# EasyEDA Pro project uven2-mk3-cc-driver-single.eprj, board uven2-mk3-cc-driver
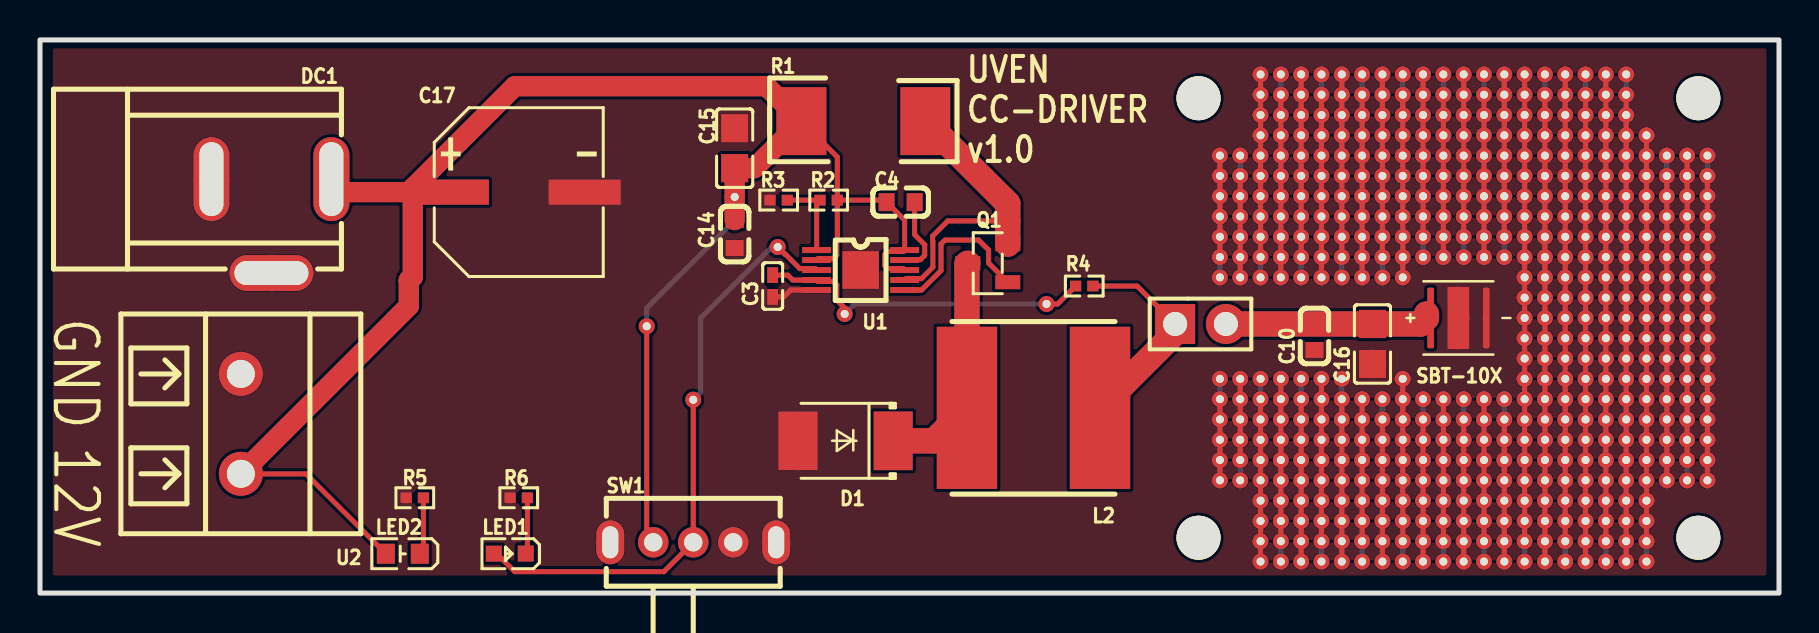
[diagram p1: board, top side]
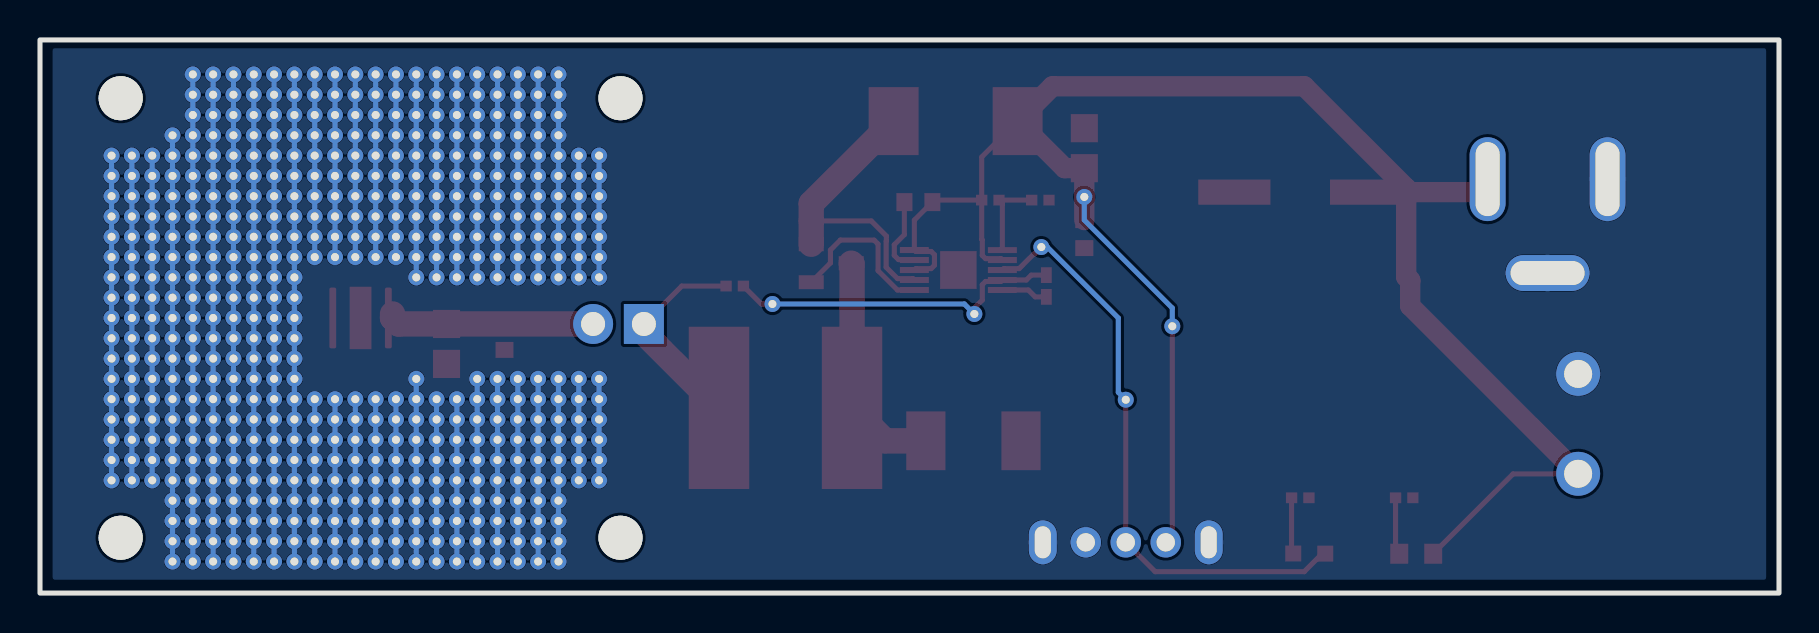
[diagram p2: board, bottom side, seen from below]

Outline 86.98 x 27.69 mm; copper layers: Top Layer, Bottom Layer. Coordinates in mm from the lower left corner of the outline.
Outline path: rectangle 0,27.69 86.98,0
Stack: Top Layer 0.035mm / Dielectric1 1.51mm FR4 er 4.5 / Bottom Layer 0.035mm

## Design rules (mm)
template: User Custom Config
spacing safeClearance (default): track to track 0.152, other pairs 0.152 to 0.3
track width trackWidth (default): min 0.127, default 0.254, max 2.54
differential pair differentialPair (default): width min 0.127, default 0.254, max 2.54; gap min 0.152, default 0.152
via viaSize (default): diameter min 0.5, default 0.61, max 10; hole min 0.3, default 0.305, max 5.999
net Net-(J3-Pin_1) uses CopperRegion3

## Placement (name value [footprint] x y rotation side)
C3  1nF  [C0402]  36.65 15.37 90 top
C4  1uF  [C0603]  43.05 19.57 180 top
C10  470nF  [C0603]  63.75 12.87 90 top
C14  1uF  [C0603]  34.75 17.97 90 top
C15  10uF  [C0805]  34.75 22.27 270 top
C16  47uF  [C0805]  66.65 12.47 90 top
C17  470uF  [CAP-SMD_BD8.0-L8.3-W8.3-LS9.1-FD]  23.95 20.07 0 top
D1  SR34_R2_00001  [SMB_L4.3-W3.6-LS5.4-R-RD]  40.29 7.62 180 top
DC1  DC-005-2.5A-2.0  [CONN-TH_DC-005-2.5A-2.0]  11.58 18.37 0 top
H1  MountingHole  [MountingHole:MountingHole_2.2mm_M2]  57.95 24.77 0 top
H2  MountingHole  [MountingHole:MountingHole_2.2mm_M2]  82.95 24.77 0 top
H3  MountingHole  [MountingHole:MountingHole_2.2mm_M2]  57.95 2.77 0 top
H4  MountingHole  [MountingHole:MountingHole_2.2mm_M2]  82.95 2.77 0 top
H5  PZ254V-11-02P  [HDR-TH_2P-P2.54-V-M]  58.05 13.47 0 top
L2  15uH  [IND-SMD_L8.0-W8.0-HPC8040NF-150M]  49.69 9.27 180 top
LED1  CSL0901BT1C  [LED0603-RD_BLUE]  23.5 1.97 180 top
LED2  XL-1608SURC-06FJ  [LED0603-FD]  18.15 1.97 0 top
NOREF  -  [Pad_e312]  40.25 13.97 0 top
NOREF#2  -  [Pad_e6127]  82.39 13.77 0 top
NOREF#3  -  [Pad_e6410]  65.11 1.58 0 top
NOREF#4  -  [Pad_e6005]  60.03 17.83 0 top
NOREF#5  -  [Pad_e6386]  66.13 2.59 0 top
NOREF#6  -  [Pad_e5849]  79.34 24.95 0 top
NOREF#7  -  [Pad_e6412]  67.15 1.58 0 top
NOREF#8  -  [Pad_e5978]  83.4 19.87 0 top
NOREF#9  -  [Pad_e5932]  62.07 20.88 0 top
NOREF#10  -  [Pad_e5981]  61.05 18.85 0 top
NOREF#11  -  [Pad_e6097]  77.31 14.79 0 top
NOREF#12  -  [Pad_e5859]  64.1 23.93 0 top
NOREF#13  -  [Pad_e6241]  71.21 8.69 0 top
NOREF#14  -  [Pad_e6009]  64.1 17.83 0 top
NOREF#15  -  [Pad_e6408]  63.08 1.58 0 top
NOREF#16  -  [Pad_e6313]  68.16 5.64 0 top
NOREF#17  -  [Pad_e6363]  68.16 3.61 0 top
NOREF#18  -  [Pad_e6201]  81.37 10.72 0 top
NOREF#19  -  [Pad_e5965]  70.19 19.87 0 top
NOREF#20  -  [Pad_e6037]  67.15 16.82 0 top
NOREF#21  -  [Pad_e6175]  80.35 11.74 0 top
NOREF#22  -  [Pad_e6148]  78.32 12.75 0 top
NOREF#23  -  [Pad_e5865]  70.19 23.93 0 top
NOREF#24  -  [Pad_e5918]  73.24 21.9 0 top
NOREF#25  -  [Pad_e5821]  76.29 25.96 0 top
NOREF#26  -  [Pad_e6123]  78.32 13.77 0 top
NOREF#27  -  [Pad_e6125]  80.35 13.77 0 top
NOREF#28  -  [Pad_e6388]  68.16 2.59 0 top
NOREF#29  -  [Pad_e5962]  67.15 19.87 0 top
NOREF#30  -  [Pad_e6212]  67.15 9.71 0 top
NOREF#31  -  [Pad_e6242]  72.23 8.69 0 top
NOREF#32  -  [Pad_e6058]  63.08 15.8 0 top
NOREF#33  -  [Pad_e5974]  79.34 19.87 0 top
NOREF#34  -  [Pad_e6332]  62.07 4.62 0 top
NOREF#35  -  [Pad_e6044]  74.26 16.82 0 top
NOREF#36  -  [Pad_e5982]  62.07 18.85 0 top
NOREF#37  -  [Pad_e6411]  66.13 1.58 0 top
NOREF#38  -  [Pad_e6415]  70.19 1.58 0 top
NOREF#39  -  [Pad_e6124]  79.34 13.77 0 top
NOREF#40  -  [Pad_e6061]  66.13 15.8 0 top
NOREF#41  -  [Pad_e6371]  76.29 3.61 0 top
NOREF#42  -  [Pad_e6381]  61.05 2.59 0 top
NOREF#43  -  [Pad_e6001]  81.37 18.85 0 top
NOREF#44  -  [Pad_e5856]  61.05 23.93 0 top
NOREF#45  -  [Pad_e6390]  70.19 2.59 0 top
NOREF#46  -  [Pad_e6199]  79.34 10.72 0 top
NOREF#47  -  [Pad_e6039]  69.18 16.82 0 top
NOREF#48  -  [Pad_e6007]  62.07 17.83 0 top
NOREF#49  -  [Pad_e6180]  60.03 10.72 0 top
NOREF#50  -  [Pad_e5954]  59.02 19.87 0 top
NOREF#51  -  [Pad_e5931]  61.05 20.88 0 top
NOREF#52  -  [Pad_e6422]  77.31 1.58 0 top
NOREF#53  -  [Pad_e6295]  75.27 6.66 0 top
NOREF#54  -  [Pad_e6368]  73.24 3.61 0 top
NOREF#55  -  [Pad_e6220]  75.27 9.71 0 top
NOREF#56  -  [Pad_e5950]  80.35 20.88 0 top
NOREF#57  -  [Pad_e5967]  72.23 19.87 0 top
NOREF#58  -  [Pad_e6038]  68.16 16.82 0 top
NOREF#59  -  [Pad_e6262]  67.15 7.67 0 top
NOREF#60  -  [Pad_e6042]  72.23 16.82 0 top
NOREF#61  -  [Pad_e6268]  73.24 7.67 0 top
NOREF#62  -  [Pad_e5894]  74.26 22.91 0 top
NOREF#63  -  [Pad_e6026]  81.37 17.83 0 top
NOREF#64  -  [Pad_e6409]  64.1 1.58 0 top
NOREF#65  -  [Pad_e5921]  76.29 21.9 0 top
NOREF#66  -  [Pad_e5947]  77.31 20.88 0 top
NOREF#67  -  [Pad_e5988]  68.16 18.85 0 top
NOREF#68  -  [Pad_e6223]  78.32 9.71 0 top
NOREF#69  -  [Pad_e5966]  71.21 19.87 0 top
NOREF#70  -  [Pad_e6146]  76.29 12.75 0 top
NOREF#71  -  [Pad_e5871]  76.29 23.93 0 top
NOREF#72  -  [Pad_e5872]  77.31 23.93 0 top
NOREF#73  -  [Pad_e6205]  60.03 9.71 0 top
NOREF#74  -  [Pad_e6216]  71.21 9.71 0 top
NOREF#75  -  [Pad_e6048]  78.32 16.82 0 top
NOREF#76  -  [Pad_e6179]  59.02 10.72 0 top
NOREF#77  -  [Pad_e6316]  71.21 5.64 0 top
NOREF#78  -  [Pad_e5984]  64.1 18.85 0 top
NOREF#79  -  [Pad_e6169]  74.26 11.74 0 top
NOREF#80  -  [Pad_e6292]  72.23 6.66 0 top
NOREF#81  -  [Pad_e5838]  68.16 24.95 0 top
NOREF#82  -  [Pad_e6305]  60.03 5.64 0 top
NOREF#83  -  [Pad_e5913]  68.16 21.9 0 top
NOREF#84  -  [Pad_e6279]  59.02 6.66 0 top
NOREF#85  -  [Pad_e5935]  65.11 20.88 0 top
NOREF#86  -  [Pad_e6230]  60.03 8.69 0 top
NOREF#87  -  [Pad_e5808]  63.08 25.96 0 top
NOREF#88  -  [Pad_e5883]  63.08 22.91 0 top
NOREF#89  -  [Pad_e6243]  73.24 8.69 0 top
NOREF#90  -  [Pad_e5897]  77.31 22.91 0 top
NOREF#91  -  [Pad_e6237]  67.15 8.69 0 top
NOREF#92  -  [Pad_e6012]  67.15 17.83 0 top
NOREF#93  -  [Pad_e5848]  78.32 24.95 0 top
NOREF#94  -  [Pad_e6000]  80.35 18.85 0 top
NOREF#95  -  [Pad_e5835]  65.11 24.95 0 top
NOREF#96  -  [Pad_e5995]  75.27 18.85 0 top
NOREF#97  -  [Pad_e6250]  80.35 8.69 0 top
NOREF#98  -  [Pad_e5937]  67.15 20.88 0 top
NOREF#99  -  [Pad_e6196]  76.29 10.72 0 top
NOREF#100  -  [Pad_e6041]  71.21 16.82 0 top
NOREF#101  -  [Pad_e5949]  79.34 20.88 0 top
NOREF#102  -  [Pad_e6393]  73.24 2.59 0 top
NOREF#103  -  [Pad_e6062]  67.15 15.8 0 top
NOREF#104  -  [Pad_e6370]  75.27 3.61 0 top
NOREF#105  -  [Pad_e5991]  71.21 18.85 0 top
NOREF#106  -  [Pad_e5815]  70.19 25.96 0 top
NOREF#107  -  [Pad_e5968]  73.24 19.87 0 top
NOREF#108  -  [Pad_e5864]  69.18 23.93 0 top
NOREF#109  -  [Pad_e6188]  68.16 10.72 0 top
NOREF#110  -  [Pad_e6280]  60.03 6.66 0 top
NOREF#111  -  [Pad_e6060]  65.11 15.8 0 top
NOREF#112  -  [Pad_e6302]  82.39 6.66 0 top
NOREF#113  -  [Pad_e5958]  63.08 19.87 0 top
NOREF#114  -  [Pad_e6306]  61.05 5.64 0 top
NOREF#115  -  [Pad_e6020]  75.27 17.83 0 top
NOREF#116  -  [Pad_e6259]  64.1 7.67 0 top
NOREF#117  -  [Pad_e327]  32.67 9.68 0 top
NOREF#118  -  [Pad_e5987]  67.15 18.85 0 top
NOREF#119  -  [Pad_e5889]  69.18 22.91 0 top
NOREF#120  -  [Pad_e5842]  72.23 24.95 0 top
NOREF#121  -  [Pad_e6049]  79.34 16.82 0 top
NOREF#122  -  [Pad_e6002]  82.39 18.85 0 top
NOREF#123  -  [Pad_e2139]  30.35 13.36 0 top
NOREF#124  -  [Pad_e6373]  78.32 3.61 0 top
NOREF#125  -  [Pad_e6277]  82.39 7.67 0 top
NOREF#126  -  [Pad_e6183]  63.08 10.72 0 top
NOREF#127  -  [Pad_e6152]  82.39 12.75 0 top
NOREF#128  -  [Pad_e5942]  72.23 20.88 0 top
NOREF#129  -  [Pad_e6263]  68.16 7.67 0 top
NOREF#130  -  [Pad_e5904]  59.02 21.9 0 top
NOREF#131  -  [Pad_e6004]  59.02 17.83 0 top
NOREF#132  -  [Pad_e5920]  75.27 21.9 0 top
NOREF#133  -  [Pad_e6194]  74.26 10.72 0 top
NOREF#134  -  [Pad_e5964]  69.18 19.87 0 top
NOREF#135  -  [Pad_e5837]  67.15 24.95 0 top
NOREF#136  -  [Pad_e6153]  83.4 12.75 0 top
NOREF#137  -  [Pad_e6320]  75.27 5.64 0 top
NOREF#138  -  [Pad_e6270]  75.27 7.67 0 top
NOREF#139  -  [Pad_e6276]  81.37 7.67 0 top
NOREF#140  -  [Pad_e5963]  68.16 19.87 0 top
NOREF#141  -  [Pad_e5934]  64.1 20.88 0 top
NOREF#142  -  [Pad_e5836]  66.13 24.95 0 top
NOREF#143  -  [Pad_e6298]  78.32 6.66 0 top
NOREF#144  -  [Pad_e6228]  83.4 9.71 0 top
NOREF#145  -  [Pad_e6238]  68.16 8.69 0 top
NOREF#146  -  [Pad_e5868]  73.24 23.93 0 top
NOREF#147  -  [Pad_e5975]  80.35 19.87 0 top
NOREF#148  -  [Pad_e6341]  71.21 4.62 0 top
NOREF#149  -  [Pad_e5977]  82.39 19.87 0 top
NOREF#150  -  [Pad_e6234]  64.1 8.69 0 top
NOREF#151  -  [Pad_e6059]  64.1 15.8 0 top
NOREF#152  -  [Pad_e6288]  68.16 6.66 0 top
NOREF#153  -  [Pad_e6389]  69.18 2.59 0 top
NOREF#154  -  [Pad_e5909]  64.1 21.9 0 top
NOREF#155  -  [Pad_e6151]  81.37 12.75 0 top
NOREF#156  -  [Pad_e6214]  69.18 9.71 0 top
NOREF#157  -  [Pad_e5960]  65.11 19.87 0 top
NOREF#158  -  [Pad_e6366]  71.21 3.61 0 top
NOREF#159  -  [Pad_e6103]  83.4 14.79 0 top
NOREF#160  -  [Pad_e6321]  76.29 5.64 0 top
NOREF#161  -  [Pad_e6076]  81.37 15.8 0 top
NOREF#162  -  [Pad_e6369]  74.26 3.61 0 top
NOREF#163  -  [Pad_e5927]  82.39 21.9 0 top
NOREF#164  -  [Pad_e6281]  61.05 6.66 0 top
NOREF#165  -  [Pad_e6232]  62.07 8.69 0 top
NOREF#166  -  [Pad_e6324]  79.34 5.64 0 top
NOREF#167  -  [Pad_e6239]  69.18 8.69 0 top
NOREF#168  -  [Pad_e6027]  82.39 17.83 0 top
NOREF#169  -  [Pad_e5970]  75.27 19.87 0 top
NOREF#170  -  [Pad_e6312]  67.15 5.64 0 top
NOREF#171  -  [Pad_e6182]  62.07 10.72 0 top
NOREF#172  -  [Pad_e6218]  73.24 9.71 0 top
NOREF#173  -  [Pad_e6395]  75.27 2.59 0 top
NOREF#174  -  [Pad_e5926]  81.37 21.9 0 top
NOREF#175  -  [Pad_e6361]  66.13 3.61 0 top
NOREF#176  -  [Pad_e6204]  59.02 9.71 0 top
NOREF#177  -  [Pad_e5884]  64.1 22.91 0 top
NOREF#178  -  [Pad_e5824]  79.34 25.96 0 top
NOREF#179  -  [Pad_e6231]  61.05 8.69 0 top
NOREF#180  -  [Pad_e5972]  77.31 19.87 0 top
NOREF#181  -  [Pad_e6206]  61.05 9.71 0 top
NOREF#182  -  [Pad_e5943]  73.24 20.88 0 top
NOREF#183  -  [Pad_e6174]  79.34 11.74 0 top
NOREF#184  -  [Pad_e6384]  64.1 2.59 0 top
NOREF#185  -  [Pad_e6095]  75.27 14.79 0 top
NOREF#186  -  [Pad_e5998]  78.32 18.85 0 top
NOREF#187  -  [Pad_e6300]  80.35 6.66 0 top
NOREF#188  -  [Pad_e6074]  79.34 15.8 0 top
NOREF#189  -  [Pad_e6229]  59.02 8.69 0 top
NOREF#190  -  [Pad_e6264]  69.18 7.67 0 top
NOREF#191  -  [Pad_e6285]  65.11 6.66 0 top
NOREF#192  -  [Pad_e6227]  82.39 9.71 0 top
NOREF#193  -  [Pad_e5980]  60.03 18.85 0 top
NOREF#194  -  [Pad_e6207]  62.07 9.71 0 top
NOREF#195  -  [Pad_e5938]  68.16 20.88 0 top
NOREF#196  -  [Pad_e6177]  82.39 11.74 0 top
NOREF#197  -  [Pad_e6016]  71.21 17.83 0 top
NOREF#198  -  [Pad_e5948]  78.32 20.88 0 top
NOREF#199  -  [Pad_e5847]  77.31 24.95 0 top
NOREF#200  -  [Pad_e6176]  81.37 11.74 0 top
NOREF#201  -  [Pad_e6198]  78.32 10.72 0 top
NOREF#202  -  [Pad_e6011]  66.13 17.83 0 top
NOREF#203  -  [Pad_e6414]  69.18 1.58 0 top
NOREF#204  -  [Pad_e6297]  77.31 6.66 0 top
NOREF#205  -  [Pad_e6398]  78.32 2.59 0 top
NOREF#206  -  [Pad_e6278]  83.4 7.67 0 top
NOREF#207  -  [Pad_e5996]  76.29 18.85 0 top
NOREF#208  -  [Pad_e6071]  76.29 15.8 0 top
NOREF#209  -  [Pad_e5862]  67.15 23.93 0 top
NOREF#210  -  [Pad_e6063]  68.16 15.8 0 top
NOREF#211  -  [Pad_e6240]  70.19 8.69 0 top
NOREF#212  -  [Pad_e6236]  66.13 8.69 0 top
NOREF#213  -  [Pad_e6215]  70.19 9.71 0 top
NOREF#214  -  [Pad_e5810]  65.11 25.96 0 top
NOREF#215  -  [Pad_e5955]  60.03 19.87 0 top
NOREF#216  -  [Pad_e6256]  61.05 7.67 0 top
NOREF#217  -  [Pad_e6195]  75.27 10.72 0 top
NOREF#218  -  [Pad_e6416]  71.21 1.58 0 top
NOREF#219  -  [Pad_e6003]  83.4 18.85 0 top
NOREF#220  -  [Pad_e5990]  70.19 18.85 0 top
NOREF#221  -  [Pad_e6319]  74.26 5.64 0 top
NOREF#222  -  [Pad_e5994]  74.26 18.85 0 top
NOREF#223  -  [Pad_e5952]  82.39 20.88 0 top
NOREF#224  -  [Pad_e5923]  78.32 21.9 0 top
NOREF#225  -  [Pad_e6128]  83.4 13.77 0 top
NOREF#226  -  [Pad_e6392]  72.23 2.59 0 top
NOREF#227  -  [Pad_e5887]  67.15 22.91 0 top
NOREF#228  -  [Pad_e5806]  61.05 25.96 0 top
NOREF#229  -  [Pad_e6261]  66.13 7.67 0 top
NOREF#230  -  [Pad_e5929]  59.02 20.88 0 top
NOREF#231  -  [Pad_e5976]  81.37 19.87 0 top
NOREF#232  -  [Pad_e6178]  83.4 11.74 0 top
NOREF#233  -  [Pad_e5840]  70.19 24.95 0 top
NOREF#234  -  [Pad_e6336]  66.13 4.62 0 top
NOREF#235  -  [Pad_e6400]  80.35 2.59 0 top
NOREF#236  -  [Pad_e5993]  73.24 18.85 0 top
NOREF#237  -  [Pad_e6308]  63.08 5.64 0 top
NOREF#238  -  [Pad_e5941]  71.21 20.88 0 top
NOREF#239  -  [Pad_e5906]  61.05 21.9 0 top
NOREF#240  -  [Pad_e5989]  69.18 18.85 0 top
NOREF#241  -  [Pad_e5896]  76.29 22.91 0 top
NOREF#242  -  [Pad_e6258]  63.08 7.67 0 top
NOREF#243  -  [Pad_e6219]  74.26 9.71 0 top
NOREF#244  -  [Pad_e5844]  74.26 24.95 0 top
NOREF#245  -  [Pad_e5939]  69.18 20.88 0 top
NOREF#246  -  [Pad_e6253]  83.4 8.69 0 top
NOREF#247  -  [Pad_e5823]  78.32 25.96 0 top
NOREF#248  -  [Pad_e6013]  68.16 17.83 0 top
NOREF#249  -  [Pad_e6221]  76.29 9.71 0 top
NOREF#250  -  [Pad_e6145]  75.27 12.75 0 top
NOREF#251  -  [Pad_e2133]  34.75 19.83 0 top
NOREF#252  -  [Pad_e5928]  83.4 21.9 0 top
NOREF#253  -  [Pad_e6052]  82.39 16.82 0 top
NOREF#254  -  [Pad_e6399]  79.34 2.59 0 top
NOREF#255  -  [Pad_e6075]  80.35 15.8 0 top
NOREF#256  -  [Pad_e5925]  80.35 21.9 0 top
NOREF#257  -  [Pad_e6033]  63.08 16.82 0 top
NOREF#258  -  [Pad_e5907]  62.07 21.9 0 top
NOREF#259  -  [Pad_e6318]  73.24 5.64 0 top
NOREF#260  -  [Pad_e6209]  64.1 9.71 0 top
NOREF#261  -  [Pad_e6222]  77.31 9.71 0 top
NOREF#262  -  [Pad_e5916]  71.21 21.9 0 top
NOREF#263  -  [Pad_e5961]  66.13 19.87 0 top
NOREF#264  -  [Pad_e6419]  74.26 1.58 0 top
NOREF#265  -  [Pad_e5997]  77.31 18.85 0 top
NOREF#266  -  [Pad_e5874]  79.34 23.93 0 top
NOREF#267  -  [Pad_e6017]  72.23 17.83 0 top
NOREF#268  -  [Pad_e6309]  64.1 5.64 0 top
NOREF#269  -  [Pad_e6322]  77.31 5.64 0 top
NOREF#270  -  [Pad_e6045]  75.27 16.82 0 top
NOREF#271  -  [Pad_e6387]  67.15 2.59 0 top
NOREF#272  -  [Pad_e5831]  61.05 24.95 0 top
NOREF#273  -  [Pad_e6372]  77.31 3.61 0 top
NOREF#274  -  [Pad_e6343]  73.24 4.62 0 top
NOREF#275  -  [Pad_e6055]  60.03 15.8 0 top
NOREF#276  -  [Pad_e6284]  64.1 6.66 0 top
NOREF#277  -  [Pad_e6181]  61.05 10.72 0 top
NOREF#278  -  [Pad_e6346]  76.29 4.62 0 top
NOREF#279  -  [Pad_e6328]  83.4 5.64 0 top
NOREF#280  -  [Pad_e6335]  65.11 4.62 0 top
NOREF#281  -  [Pad_e6382]  62.07 2.59 0 top
NOREF#282  -  [Pad_e6407]  62.07 1.58 0 top
NOREF#283  -  [Pad_e5911]  66.13 21.9 0 top
NOREF#284  -  [Pad_e5809]  64.1 25.96 0 top
NOREF#285  -  [Pad_e5912]  67.15 21.9 0 top
NOREF#286  -  [Pad_e6208]  63.08 9.71 0 top
NOREF#287  -  [Pad_e6360]  65.11 3.61 0 top
NOREF#288  -  [Pad_e6323]  78.32 5.64 0 top
NOREF#289  -  [Pad_e6171]  76.29 11.74 0 top
NOREF#290  -  [Pad_e5924]  79.34 21.9 0 top
NOREF#291  -  [Pad_e6274]  79.34 7.67 0 top
NOREF#292  -  [Pad_e6200]  80.35 10.72 0 top
NOREF#293  -  [Pad_e6394]  74.26 2.59 0 top
NOREF#294  -  [Pad_e6006]  61.05 17.83 0 top
NOREF#295  -  [Pad_e6072]  77.31 15.8 0 top
NOREF#296  -  [Pad_e6271]  76.29 7.67 0 top
NOREF#297  -  [Pad_e6293]  73.24 6.66 0 top
NOREF#298  -  [Pad_e5933]  63.08 20.88 0 top
NOREF#299  -  [Pad_e5910]  65.11 21.9 0 top
NOREF#300  -  [Pad_e5886]  66.13 22.91 0 top
NOREF#301  -  [Pad_e5857]  62.07 23.93 0 top
NOREF#302  -  [Pad_e6021]  76.29 17.83 0 top
NOREF#303  -  [Pad_e6397]  77.31 2.59 0 top
NOREF#304  -  [Pad_e6383]  63.08 2.59 0 top
NOREF#305  -  [Pad_e6099]  79.34 14.79 0 top
NOREF#306  -  [Pad_e5919]  74.26 21.9 0 top
NOREF#307  -  [Pad_e6202]  82.39 10.72 0 top
NOREF#308  -  [Pad_e6244]  74.26 8.69 0 top
NOREF#309  -  [Pad_e6364]  69.18 3.61 0 top
NOREF#310  -  [Pad_e6051]  81.37 16.82 0 top
NOREF#311  -  [Pad_e6385]  65.11 2.59 0 top
NOREF#312  -  [Pad_e6296]  76.29 6.66 0 top
NOREF#313  -  [Pad_e6291]  71.21 6.66 0 top
NOREF#314  -  [Pad_e5986]  66.13 18.85 0 top
NOREF#315  -  [Pad_e5869]  74.26 23.93 0 top
NOREF#316  -  [Pad_e5944]  74.26 20.88 0 top
NOREF#317  -  [Pad_e6070]  75.27 15.8 0 top
NOREF#318  -  [Pad_e6362]  67.15 3.61 0 top
NOREF#319  -  [Pad_e6269]  74.26 7.67 0 top
NOREF#320  -  [Pad_e325]  36.9 17.32 0 top
NOREF#321  -  [Pad_e6047]  77.31 16.82 0 top
NOREF#322  -  [Pad_e6246]  76.29 8.69 0 top
NOREF#323  -  [Pad_e5858]  63.08 23.93 0 top
NOREF#324  -  [Pad_e5922]  77.31 21.9 0 top
NOREF#325  -  [Pad_e6326]  81.37 5.64 0 top
NOREF#326  -  [Pad_e6040]  70.19 16.82 0 top
NOREF#327  -  [Pad_e6028]  83.4 17.83 0 top
NOREF#328  -  [Pad_e5873]  78.32 23.93 0 top
NOREF#329  -  [Pad_e5890]  70.19 22.91 0 top
NOREF#330  -  [Pad_e6365]  70.19 3.61 0 top
NOREF#331  -  [Pad_e6272]  77.31 7.67 0 top
NOREF#332  -  [Pad_e5841]  71.21 24.95 0 top
NOREF#333  -  [Pad_e6289]  69.18 6.66 0 top
NOREF#334  -  [Pad_e5892]  72.23 22.91 0 top
NOREF#335  -  [Pad_e6226]  81.37 9.71 0 top
NOREF#336  -  [Pad_e5951]  81.37 20.88 0 top
NOREF#337  -  [Pad_e5833]  63.08 24.95 0 top
NOREF#338  -  [Pad_e6350]  80.35 4.62 0 top
NOREF#339  -  [Pad_e5914]  69.18 21.9 0 top
NOREF#340  -  [Pad_e5956]  61.05 19.87 0 top
NOREF#341  -  [Pad_e6184]  64.1 10.72 0 top
NOREF#342  -  [Pad_e6197]  77.31 10.72 0 top
NOREF#343  -  [Pad_e6018]  73.24 17.83 0 top
NOREF#344  -  [Pad_e6025]  80.35 17.83 0 top
NOREF#345  -  [Pad_e6217]  72.23 9.71 0 top
NOREF#346  -  [Pad_e5893]  73.24 22.91 0 top
NOREF#347  -  [Pad_e6331]  61.05 4.62 0 top
NOREF#348  -  [Pad_e6149]  79.34 12.75 0 top
NOREF#349  -  [Pad_e6078]  83.4 15.8 0 top
NOREF#350  -  [Pad_e6347]  77.31 4.62 0 top
NOREF#351  -  [Pad_e6265]  70.19 7.67 0 top
NOREF#352  -  [Pad_e6030]  60.03 16.82 0 top
NOREF#353  -  [Pad_e6334]  64.1 4.62 0 top
NOREF#354  -  [Pad_e5819]  74.26 25.96 0 top
NOREF#355  -  [Pad_e6325]  80.35 5.64 0 top
NOREF#356  -  [Pad_e6010]  65.11 17.83 0 top
NOREF#357  -  [Pad_e6283]  63.08 6.66 0 top
NOREF#358  -  [Pad_e6032]  62.07 16.82 0 top
NOREF#359  -  [Pad_e5870]  75.27 23.93 0 top
NOREF#360  -  [Pad_e6035]  65.11 16.82 0 top
NOREF#361  -  [Pad_e6036]  66.13 16.82 0 top
NOREF#362  -  [Pad_e6247]  77.31 8.69 0 top
NOREF#363  -  [Pad_e5846]  76.29 24.95 0 top
NOREF#364  -  [Pad_e6053]  83.4 16.82 0 top
NOREF#365  -  [Pad_e5881]  61.05 22.91 0 top
NOREF#366  -  [Pad_e6267]  72.23 7.67 0 top
NOREF#367  -  [Pad_e6421]  76.29 1.58 0 top
NOREF#368  -  [Pad_e6375]  80.35 3.61 0 top
NOREF#369  -  [Pad_e6417]  72.23 1.58 0 top
NOREF#370  -  [Pad_e5817]  72.23 25.96 0 top
NOREF#371  -  [Pad_e6126]  81.37 13.77 0 top
NOREF#372  -  [Pad_e6057]  62.07 15.8 0 top
NOREF#373  -  [Pad_e6008]  63.08 17.83 0 top
NOREF#374  -  [Pad_e6356]  61.05 3.61 0 top
NOREF#375  -  [Pad_e5973]  78.32 19.87 0 top
NOREF#376  -  [Pad_e5866]  71.21 23.93 0 top
NOREF#377  -  [Pad_e6391]  71.21 2.59 0 top
NOREF#378  -  [Pad_e6342]  72.23 4.62 0 top
NOREF#379  -  [Pad_e6307]  62.07 5.64 0 top
NOREF#380  -  [Pad_e6170]  75.27 11.74 0 top
NOREF#381  -  [Pad_e6357]  62.07 3.61 0 top
NOREF#382  -  [Pad_e6310]  65.11 5.64 0 top
NOREF#383  -  [Pad_e6338]  68.16 4.62 0 top
NOREF#384  -  [Pad_e6299]  79.34 6.66 0 top
NOREF#385  -  [Pad_e6413]  68.16 1.58 0 top
NOREF#386  -  [Pad_e6359]  64.1 3.61 0 top
NOREF#387  -  [Pad_e5899]  79.34 22.91 0 top
NOREF#388  -  [Pad_e6024]  79.34 17.83 0 top
NOREF#389  -  [Pad_e308]  50.35 14.47 0 top
NOREF#390  -  [Pad_e6251]  81.37 8.69 0 top
NOREF#391  -  [Pad_e5983]  63.08 18.85 0 top
NOREF#392  -  [Pad_e5979]  59.02 18.85 0 top
NOREF#393  -  [Pad_e5915]  70.19 21.9 0 top
NOREF#394  -  [Pad_e5908]  63.08 21.9 0 top
NOREF#395  -  [Pad_e6275]  80.35 7.67 0 top
NOREF#396  -  [Pad_e6245]  75.27 8.69 0 top
NOREF#397  -  [Pad_e5807]  62.07 25.96 0 top
NOREF#398  -  [Pad_e5945]  75.27 20.88 0 top
NOREF#399  -  [Pad_e6224]  79.34 9.71 0 top
NOREF#400  -  [Pad_e6304]  59.02 5.64 0 top
NOREF#401  -  [Pad_e5818]  73.24 25.96 0 top
NOREF#402  -  [Pad_e6301]  81.37 6.66 0 top
NOREF#403  -  [Pad_e6314]  69.18 5.64 0 top
NOREF#404  -  [Pad_e5811]  66.13 25.96 0 top
NOREF#405  -  [Pad_e6252]  82.39 8.69 0 top
NOREF#406  -  [Pad_e6211]  66.13 9.71 0 top
NOREF#407  -  [Pad_e6344]  74.26 4.62 0 top
NOREF#408  -  [Pad_e6396]  76.29 2.59 0 top
NOREF#409  -  [Pad_e5895]  75.27 22.91 0 top
NOREF#410  -  [Pad_e5813]  68.16 25.96 0 top
NOREF#411  -  [Pad_e6029]  59.02 16.82 0 top
NOREF#412  -  [Pad_e5861]  66.13 23.93 0 top
NOREF#413  -  [Pad_e6019]  74.26 17.83 0 top
NOREF#414  -  [Pad_e6290]  70.19 6.66 0 top
NOREF#415  -  [Pad_e5816]  71.21 25.96 0 top
NOREF#416  -  [Pad_e5814]  69.18 25.96 0 top
NOREF#417  -  [Pad_e6294]  74.26 6.66 0 top
NOREF#418  -  [Pad_e6317]  72.23 5.64 0 top
NOREF#419  -  [Pad_e6098]  78.32 14.79 0 top
NOREF#420  -  [Pad_e6286]  66.13 6.66 0 top
NOREF#421  -  [Pad_e6096]  76.29 14.79 0 top
NOREF#422  -  [Pad_e6311]  66.13 5.64 0 top
NOREF#423  -  [Pad_e6022]  77.31 17.83 0 top
NOREF#424  -  [Pad_e6327]  82.39 5.64 0 top
NOREF#425  -  [Pad_e6420]  75.27 1.58 0 top
NOREF#426  -  [Pad_e5930]  60.03 20.88 0 top
NOREF#427  -  [Pad_e5845]  75.27 24.95 0 top
NOREF#428  -  [Pad_e6050]  80.35 16.82 0 top
NOREF#429  -  [Pad_e5917]  72.23 21.9 0 top
NOREF#430  -  [Pad_e6213]  68.16 9.71 0 top
NOREF#431  -  [Pad_e6172]  77.31 11.74 0 top
NOREF#432  -  [Pad_e6315]  70.19 5.64 0 top
NOREF#433  -  [Pad_e6210]  65.11 9.71 0 top
NOREF#434  -  [Pad_e6273]  78.32 7.67 0 top
NOREF#435  -  [Pad_e5812]  67.15 25.96 0 top
NOREF#436  -  [Pad_e6425]  80.35 1.58 0 top
NOREF#437  -  [Pad_e5946]  76.29 20.88 0 top
NOREF#438  -  [Pad_e6255]  60.03 7.67 0 top
NOREF#439  -  [Pad_e6282]  62.07 6.66 0 top
NOREF#440  -  [Pad_e6034]  64.1 16.82 0 top
NOREF#441  -  [Pad_e6056]  61.05 15.8 0 top
NOREF#442  -  [Pad_e6418]  73.24 1.58 0 top
NOREF#443  -  [Pad_e6339]  69.18 4.62 0 top
NOREF#444  -  [Pad_e5969]  74.26 19.87 0 top
NOREF#445  -  [Pad_e5992]  72.23 18.85 0 top
NOREF#446  -  [Pad_e6147]  77.31 12.75 0 top
NOREF#447  -  [Pad_e5839]  69.18 24.95 0 top
NOREF#448  -  [Pad_e6260]  65.11 7.67 0 top
NOREF#449  -  [Pad_e5999]  79.34 18.85 0 top
NOREF#450  -  [Pad_e6287]  67.15 6.66 0 top
NOREF#451  -  [Pad_e6185]  65.11 10.72 0 top
NOREF#452  -  [Pad_e5885]  65.11 22.91 0 top
NOREF#453  -  [Pad_e5905]  60.03 21.9 0 top
NOREF#454  -  [Pad_e6358]  63.08 3.61 0 top
NOREF#455  -  [Pad_e6077]  82.39 15.8 0 top
NOREF#456  -  [Pad_e5900]  80.35 22.91 0 top
NOREF#457  -  [Pad_e5959]  64.1 19.87 0 top
NOREF#458  -  [Pad_e6101]  81.37 14.79 0 top
NOREF#459  -  [Pad_e6054]  59.02 15.8 0 top
NOREF#460  -  [Pad_e6073]  78.32 15.8 0 top
NOREF#461  -  [Pad_e5822]  77.31 25.96 0 top
NOREF#462  -  [Pad_e6094]  74.26 14.79 0 top
NOREF#463  -  [Pad_e5940]  70.19 20.88 0 top
NOREF#464  -  [Pad_e5891]  71.21 22.91 0 top
NOREF#465  -  [Pad_e6257]  62.07 7.67 0 top
NOREF#466  -  [Pad_e6102]  82.39 14.79 0 top
NOREF#467  -  [Pad_e6248]  78.32 8.69 0 top
NOREF#468  -  [Pad_e6348]  78.32 4.62 0 top
NOREF#469  -  [Pad_e6046]  76.29 16.82 0 top
NOREF#470  -  [Pad_e6119]  74.26 13.77 0 top
NOREF#471  -  [Pad_e5820]  75.27 25.96 0 top
NOREF#472  -  [Pad_e5867]  72.23 23.93 0 top
NOREF#473  -  [Pad_e5936]  66.13 20.88 0 top
NOREF#474  -  [Pad_e6225]  80.35 9.71 0 top
NOREF#475  -  [Pad_e6031]  61.05 16.82 0 top
NOREF#476  -  [Pad_e6424]  79.34 1.58 0 top
NOREF#477  -  [Pad_e5985]  65.11 18.85 0 top
NOREF#478  -  [Pad_e6173]  78.32 11.74 0 top
NOREF#479  -  [Pad_e6367]  72.23 3.61 0 top
NOREF#480  -  [Pad_e5834]  64.1 24.95 0 top
NOREF#481  -  [Pad_e6144]  74.26 12.75 0 top
NOREF#482  -  [Pad_e6122]  77.31 13.77 0 top
NOREF#483  -  [Pad_e5863]  68.16 23.93 0 top
NOREF#484  -  [Pad_e6203]  83.4 10.72 0 top
NOREF#485  -  [Pad_e6303]  83.4 6.66 0 top
NOREF#486  -  [Pad_e6100]  80.35 14.79 0 top
NOREF#487  -  [Pad_e6333]  63.08 4.62 0 top
NOREF#488  -  [Pad_e6121]  76.29 13.77 0 top
NOREF#489  -  [Pad_e6374]  79.34 3.61 0 top
NOREF#490  -  [Pad_e6235]  65.11 8.69 0 top
NOREF#491  -  [Pad_e6233]  63.08 8.69 0 top
NOREF#492  -  [Pad_e6150]  80.35 12.75 0 top
NOREF#493  -  [Pad_e5898]  78.32 22.91 0 top
NOREF#494  -  [Pad_e5971]  76.29 19.87 0 top
NOREF#495  -  [Pad_e6015]  70.19 17.83 0 top
NOREF#496  -  [Pad_e6254]  59.02 7.67 0 top
NOREF#497  -  [Pad_e5882]  62.07 22.91 0 top
NOREF#498  -  [Pad_e6069]  74.26 15.8 0 top
NOREF#499  -  [Pad_e6340]  70.19 4.62 0 top
NOREF#500  -  [Pad_e6266]  71.21 7.67 0 top
NOREF#501  -  [Pad_e6345]  75.27 4.62 0 top
NOREF#502  -  [Pad_e5843]  73.24 24.95 0 top
NOREF#503  -  [Pad_e6349]  79.34 4.62 0 top
NOREF#504  -  [Pad_e6120]  75.27 13.77 0 top
NOREF#505  -  [Pad_e6337]  67.15 4.62 0 top
NOREF#506  -  [Pad_e6406]  61.05 1.58 0 top
NOREF#507  -  [Pad_e6014]  69.18 17.83 0 top
NOREF#508  -  [Pad_e5860]  65.11 23.93 0 top
NOREF#509  -  [Pad_e6043]  73.24 16.82 0 top
NOREF#510  -  [Pad_e5957]  62.07 19.87 0 top
NOREF#511  -  [Pad_e6249]  79.34 8.69 0 top
NOREF#512  -  [Pad_e6023]  78.32 17.83 0 top
NOREF#513  -  [Pad_e5832]  62.07 24.95 0 top
NOREF#514  -  [Pad_e5888]  68.16 22.91 0 top
NOREF#515  -  [Pad_e5953]  83.4 20.88 0 top
NOREF#516  -  [Pad_e6423]  78.32 1.58 0 top
Q1  AO3401A  [SOT-23-3_L2.9-W1.3-P1.90-LS2.4-BR]  47.41 16.51 0 top
R1  80mΩ  [RES-SMD_L6.4-W3.2-1]  41.18 23.62 180 top
R2  24kΩ  [R0402]  39.45 19.67 0 top
R3  4.7kΩ  [R0402]  36.95 19.67 0 top
R4  6.2kΩ  [R0402]  52.23 15.37 0 top
R5  1kΩ  [R0402]  18.75 4.77 0 top
R6  1kΩ  [R0402]  23.95 4.77 0 top
SBT-10X  SBT-10X-UV-A120-AH380-22  [custom_lib:LED_SBT-10X-UV-A120-AH380-22]  70.95 13.77 180 top
SW1  SK12D07VG4  [SW-TH_SK12D07VG4]  32.67 2.54 0 top
U1  LM3409MY/NOPB  [HVSSOP-10_L3.0-W3.0-P0.50-LS4.9-BL-EP]  41.05 16.17 270 top
U2  DB127S-5.0-2P-GN-S  [CONN-TH_DB127S-5.0-2P-GN-S]  10.05 8.47 270 top

## Footprints (pads in the part's own frame, mm; a bottom-side part is the same pattern mirrored in y, then rotated)
C0402
  rect 0.79x0.54 smd: 1(-0.545,0) 2(0.545,0)
C0603
  rect 0.8x0.9 smd: 1(-0.7,0) 2(0.7,0)
C0805
  rect 1.41x1.35 smd: 1(-1,0) 2(1,0)
CAP-SMD_BD8.0-L8.3-W8.3-LS9.1-FD
  rect 3.61x1.26 smd: 1(-3.295,0) 2(3.295,0)
CONN-TH_DB127S-5.0-2P-GN-S
  round 2.2 hole 1.4: 1(-2.5,0) 2(2.5,0)
CONN-TH_DC-005-2.5A-2.0
  oval 1.8x4.2 hole 1.2x3.7: 1(2.999,2.35) 2(-2.999,2.35)
  oval 4.2x1.8 hole 3.7x1.2: 3(0,-2.35)
custom_lib:LED_SBT-10X-UV-A120-AH380-22
  rrect 0.34x3.04 smd: A(1.39,0) C(-1.39,0)
  rect 1.092x3.124 smd: EXP(0,0)
HDR-TH_2P-P2.54-V-M
  rect 2x2 hole 1.2: 1(-1.27,0)
  round 2 hole 1.2: 2(1.27,0)
HVSSOP-10_L3.0-W3.0-P0.50-LS4.9-BL-EP
  rect 0.3x1.45 smd: 1(-1,-2.201) 2(-0.5,-2.201) 3(0.001,-2.201) 4(0.5,-2.201) 5(1,-2.201) 6(1,2.201) 7(0.5,2.201) 8(0,2.201) 9(-0.5,2.201) 10(-1,2.201)
  rect 1.89x1.83 smd: 11(-0.001,-0.001)
IND-SMD_L8.0-W8.0-HPC8040NF-150M
  rect 3.024x8.12 smd: 1(3.328,0) 2(-3.328,0)
LED0603-FD
  rect 0.9x1 smd: 1(-0.85,0) 2(0.85,0)
LED0603-RD_BLUE
  rect 0.8x0.8 smd: 1(-0.799,-0.004) 2(0.799,0.004)
MountingHole:MountingHole_2.2mm_M2
  round 2.2 hole 2.2: (0,0)
Pad_e308
  round 0.8 hole 0.4: 1(0,0)
Pad_e312
  round 0.8 hole 0.4: 1(0,0)
Pad_e325
  round 0.8 hole 0.4: 1(0,0)
Pad_e327
  round 0.8 hole 0.4: 1(0,0)
Pad_e2133
  round 0.8 hole 0.4: 1(0,0)
Pad_e2139
  round 0.8 hole 0.4: 1(0,0)
Pad_e5806
  round 0.8 hole 0.4: 12(0,0)
Pad_e5807
  round 0.8 hole 0.4: 13(0,0)
Pad_e5808
  round 0.8 hole 0.4: 14(0,0)
Pad_e5809
  round 0.8 hole 0.4: 15(0,0)
Pad_e5810
  round 0.8 hole 0.4: 16(0,0)
Pad_e5811
  round 0.8 hole 0.4: 17(0,0)
Pad_e5812
  round 0.8 hole 0.4: 18(0,0)
Pad_e5813
  round 0.8 hole 0.4: 19(0,0)
Pad_e5814
  round 0.8 hole 0.4: 20(0,0)
Pad_e5815
  round 0.8 hole 0.4: 21(0,0)
Pad_e5816
  round 0.8 hole 0.4: 22(0,0)
Pad_e5817
  round 0.8 hole 0.4: 23(0,0)
Pad_e5818
  round 0.8 hole 0.4: 24(0,0)
Pad_e5819
  round 0.8 hole 0.4: 25(0,0)
Pad_e5820
  round 0.8 hole 0.4: 26(0,0)
Pad_e5821
  round 0.8 hole 0.4: 27(0,0)
Pad_e5822
  round 0.8 hole 0.4: 28(0,0)
Pad_e5823
  round 0.8 hole 0.4: 29(0,0)
Pad_e5824
  round 0.8 hole 0.4: 30(0,0)
Pad_e5831
  round 0.8 hole 0.4: 37(0,0)
Pad_e5832
  round 0.8 hole 0.4: 38(0,0)
Pad_e5833
  round 0.8 hole 0.4: 39(0,0)
Pad_e5834
  round 0.8 hole 0.4: 40(0,0)
Pad_e5835
  round 0.8 hole 0.4: 41(0,0)
Pad_e5836
  round 0.8 hole 0.4: 42(0,0)
Pad_e5837
  round 0.8 hole 0.4: 43(0,0)
Pad_e5838
  round 0.8 hole 0.4: 44(0,0)
Pad_e5839
  round 0.8 hole 0.4: 45(0,0)
Pad_e5840
  round 0.8 hole 0.4: 46(0,0)
Pad_e5841
  round 0.8 hole 0.4: 47(0,0)
Pad_e5842
  round 0.8 hole 0.4: 48(0,0)
Pad_e5843
  round 0.8 hole 0.4: 49(0,0)
Pad_e5844
  round 0.8 hole 0.4: 50(0,0)
Pad_e5845
  round 0.8 hole 0.4: 51(0,0)
Pad_e5846
  round 0.8 hole 0.4: 52(0,0)
Pad_e5847
  round 0.8 hole 0.4: 53(0,0)
Pad_e5848
  round 0.8 hole 0.4: 54(0,0)
Pad_e5849
  round 0.8 hole 0.4: 55(0,0)
Pad_e5856
  round 0.8 hole 0.4: 62(0,0)
Pad_e5857
  round 0.8 hole 0.4: 63(0,0)
Pad_e5858
  round 0.8 hole 0.4: 64(0,0)
Pad_e5859
  round 0.8 hole 0.4: 65(0,0)
Pad_e5860
  round 0.8 hole 0.4: 66(0,0)
Pad_e5861
  round 0.8 hole 0.4: 67(0,0)
Pad_e5862
  round 0.8 hole 0.4: 68(0,0)
Pad_e5863
  round 0.8 hole 0.4: 69(0,0)
Pad_e5864
  round 0.8 hole 0.4: 70(0,0)
Pad_e5865
  round 0.8 hole 0.4: 71(0,0)
Pad_e5866
  round 0.8 hole 0.4: 72(0,0)
Pad_e5867
  round 0.8 hole 0.4: 73(0,0)
Pad_e5868
  round 0.8 hole 0.4: 74(0,0)
Pad_e5869
  round 0.8 hole 0.4: 75(0,0)
Pad_e5870
  round 0.8 hole 0.4: 76(0,0)
Pad_e5871
  round 0.8 hole 0.4: 77(0,0)
Pad_e5872
  round 0.8 hole 0.4: 78(0,0)
Pad_e5873
  round 0.8 hole 0.4: 79(0,0)
Pad_e5874
  round 0.8 hole 0.4: 80(0,0)
Pad_e5881
  round 0.8 hole 0.4: 87(0,0)
Pad_e5882
  round 0.8 hole 0.4: 88(0,0)
Pad_e5883
  round 0.8 hole 0.4: 89(0,0)
Pad_e5884
  round 0.8 hole 0.4: 90(0,0)
Pad_e5885
  round 0.8 hole 0.4: 91(0,0)
Pad_e5886
  round 0.8 hole 0.4: 92(0,0)
Pad_e5887
  round 0.8 hole 0.4: 93(0,0)
Pad_e5888
  round 0.8 hole 0.4: 94(0,0)
Pad_e5889
  round 0.8 hole 0.4: 95(0,0)
Pad_e5890
  round 0.8 hole 0.4: 96(0,0)
Pad_e5891
  round 0.8 hole 0.4: 97(0,0)
Pad_e5892
  round 0.8 hole 0.4: 98(0,0)
Pad_e5893
  round 0.8 hole 0.4: 99(0,0)
Pad_e5894
  round 0.8 hole 0.4: 100(0,0)
Pad_e5895
  round 0.8 hole 0.4: 101(0,0)
Pad_e5896
  round 0.8 hole 0.4: 102(0,0)
Pad_e5897
  round 0.8 hole 0.4: 103(0,0)
Pad_e5898
  round 0.8 hole 0.4: 104(0,0)
Pad_e5899
  round 0.8 hole 0.4: 105(0,0)
Pad_e5900
  round 0.8 hole 0.4: 106(0,0)
Pad_e5904
  round 0.8 hole 0.4: 110(0,0)
Pad_e5905
  round 0.8 hole 0.4: 111(0,0)
Pad_e5906
  round 0.8 hole 0.4: 112(0,0)
Pad_e5907
  round 0.8 hole 0.4: 113(0,0)
Pad_e5908
  round 0.8 hole 0.4: 114(0,0)
Pad_e5909
  round 0.8 hole 0.4: 115(0,0)
Pad_e5910
  round 0.8 hole 0.4: 116(0,0)
Pad_e5911
  round 0.8 hole 0.4: 117(0,0)
Pad_e5912
  round 0.8 hole 0.4: 118(0,0)
Pad_e5913
  round 0.8 hole 0.4: 119(0,0)
Pad_e5914
  round 0.8 hole 0.4: 120(0,0)
Pad_e5915
  round 0.8 hole 0.4: 121(0,0)
Pad_e5916
  round 0.8 hole 0.4: 122(0,0)
Pad_e5917
  round 0.8 hole 0.4: 123(0,0)
Pad_e5918
  round 0.8 hole 0.4: 124(0,0)
Pad_e5919
  round 0.8 hole 0.4: 125(0,0)
Pad_e5920
  round 0.8 hole 0.4: 126(0,0)
Pad_e5921
  round 0.8 hole 0.4: 127(0,0)
Pad_e5922
  round 0.8 hole 0.4: 128(0,0)
Pad_e5923
  round 0.8 hole 0.4: 129(0,0)
Pad_e5924
  round 0.8 hole 0.4: 130(0,0)
Pad_e5925
  round 0.8 hole 0.4: 131(0,0)
Pad_e5926
  round 0.8 hole 0.4: 132(0,0)
Pad_e5927
  round 0.8 hole 0.4: 133(0,0)
Pad_e5928
  round 0.8 hole 0.4: 134(0,0)
Pad_e5929
  round 0.8 hole 0.4: 135(0,0)
Pad_e5930
  round 0.8 hole 0.4: 136(0,0)
Pad_e5931
  round 0.8 hole 0.4: 137(0,0)
Pad_e5932
  round 0.8 hole 0.4: 138(0,0)
Pad_e5933
  round 0.8 hole 0.4: 139(0,0)
Pad_e5934
  round 0.8 hole 0.4: 140(0,0)
Pad_e5935
  round 0.8 hole 0.4: 141(0,0)
Pad_e5936
  round 0.8 hole 0.4: 142(0,0)
Pad_e5937
  round 0.8 hole 0.4: 143(0,0)
Pad_e5938
  round 0.8 hole 0.4: 144(0,0)
Pad_e5939
  round 0.8 hole 0.4: 145(0,0)
Pad_e5940
  round 0.8 hole 0.4: 146(0,0)
Pad_e5941
  round 0.8 hole 0.4: 147(0,0)
Pad_e5942
  round 0.8 hole 0.4: 148(0,0)
Pad_e5943
  round 0.8 hole 0.4: 149(0,0)
Pad_e5944
  round 0.8 hole 0.4: 150(0,0)
Pad_e5945
  round 0.8 hole 0.4: 151(0,0)
Pad_e5946
  round 0.8 hole 0.4: 152(0,0)
Pad_e5947
  round 0.8 hole 0.4: 153(0,0)
Pad_e5948
  round 0.8 hole 0.4: 154(0,0)
Pad_e5949
  round 0.8 hole 0.4: 155(0,0)
Pad_e5950
  round 0.8 hole 0.4: 156(0,0)
Pad_e5951
  round 0.8 hole 0.4: 157(0,0)
Pad_e5952
  round 0.8 hole 0.4: 158(0,0)
Pad_e5953
  round 0.8 hole 0.4: 159(0,0)
Pad_e5954
  round 0.8 hole 0.4: 160(0,0)
Pad_e5955
  round 0.8 hole 0.4: 161(0,0)
Pad_e5956
  round 0.8 hole 0.4: 162(0,0)
Pad_e5957
  round 0.8 hole 0.4: 163(0,0)
Pad_e5958
  round 0.8 hole 0.4: 164(0,0)
Pad_e5959
  round 0.8 hole 0.4: 165(0,0)
Pad_e5960
  round 0.8 hole 0.4: 166(0,0)
Pad_e5961
  round 0.8 hole 0.4: 167(0,0)
Pad_e5962
  round 0.8 hole 0.4: 168(0,0)
Pad_e5963
  round 0.8 hole 0.4: 169(0,0)
Pad_e5964
  round 0.8 hole 0.4: 170(0,0)
Pad_e5965
  round 0.8 hole 0.4: 171(0,0)
Pad_e5966
  round 0.8 hole 0.4: 172(0,0)
Pad_e5967
  round 0.8 hole 0.4: 173(0,0)
Pad_e5968
  round 0.8 hole 0.4: 174(0,0)
Pad_e5969
  round 0.8 hole 0.4: 175(0,0)
Pad_e5970
  round 0.8 hole 0.4: 176(0,0)
Pad_e5971
  round 0.8 hole 0.4: 177(0,0)
Pad_e5972
  round 0.8 hole 0.4: 178(0,0)
Pad_e5973
  round 0.8 hole 0.4: 179(0,0)
Pad_e5974
  round 0.8 hole 0.4: 180(0,0)
Pad_e5975
  round 0.8 hole 0.4: 181(0,0)
Pad_e5976
  round 0.8 hole 0.4: 182(0,0)
Pad_e5977
  round 0.8 hole 0.4: 183(0,0)
Pad_e5978
  round 0.8 hole 0.4: 184(0,0)
Pad_e5979
  round 0.8 hole 0.4: 185(0,0)
Pad_e5980
  round 0.8 hole 0.4: 186(0,0)
Pad_e5981
  round 0.8 hole 0.4: 187(0,0)
Pad_e5982
  round 0.8 hole 0.4: 188(0,0)
Pad_e5983
  round 0.8 hole 0.4: 189(0,0)
Pad_e5984
  round 0.8 hole 0.4: 190(0,0)
Pad_e5985
  round 0.8 hole 0.4: 191(0,0)
Pad_e5986
  round 0.8 hole 0.4: 192(0,0)
Pad_e5987
  round 0.8 hole 0.4: 193(0,0)
Pad_e5988
  round 0.8 hole 0.4: 194(0,0)
Pad_e5989
  round 0.8 hole 0.4: 195(0,0)
Pad_e5990
  round 0.8 hole 0.4: 196(0,0)
Pad_e5991
  round 0.8 hole 0.4: 197(0,0)
Pad_e5992
  round 0.8 hole 0.4: 198(0,0)
Pad_e5993
  round 0.8 hole 0.4: 199(0,0)
Pad_e5994
  round 0.8 hole 0.4: 200(0,0)
Pad_e5995
  round 0.8 hole 0.4: 201(0,0)
Pad_e5996
  round 0.8 hole 0.4: 202(0,0)
Pad_e5997
  round 0.8 hole 0.4: 203(0,0)
Pad_e5998
  round 0.8 hole 0.4: 204(0,0)
Pad_e5999
  round 0.8 hole 0.4: 205(0,0)
Pad_e6000
  round 0.8 hole 0.4: 206(0,0)
Pad_e6001
  round 0.8 hole 0.4: 207(0,0)
Pad_e6002
  round 0.8 hole 0.4: 208(0,0)
Pad_e6003
  round 0.8 hole 0.4: 209(0,0)
Pad_e6004
  round 0.8 hole 0.4: 210(0,0)
Pad_e6005
  round 0.8 hole 0.4: 211(0,0)
Pad_e6006
  round 0.8 hole 0.4: 212(0,0)
Pad_e6007
  round 0.8 hole 0.4: 213(0,0)
Pad_e6008
  round 0.8 hole 0.4: 214(0,0)
Pad_e6009
  round 0.8 hole 0.4: 215(0,0)
Pad_e6010
  round 0.8 hole 0.4: 216(0,0)
Pad_e6011
  round 0.8 hole 0.4: 217(0,0)
Pad_e6012
  round 0.8 hole 0.4: 218(0,0)
Pad_e6013
  round 0.8 hole 0.4: 219(0,0)
Pad_e6014
  round 0.8 hole 0.4: 220(0,0)
Pad_e6015
  round 0.8 hole 0.4: 221(0,0)
Pad_e6016
  round 0.8 hole 0.4: 222(0,0)
Pad_e6017
  round 0.8 hole 0.4: 223(0,0)
Pad_e6018
  round 0.8 hole 0.4: 224(0,0)
Pad_e6019
  round 0.8 hole 0.4: 225(0,0)
Pad_e6020
  round 0.8 hole 0.4: 226(0,0)
Pad_e6021
  round 0.8 hole 0.4: 227(0,0)
Pad_e6022
  round 0.8 hole 0.4: 228(0,0)
Pad_e6023
  round 0.8 hole 0.4: 229(0,0)
Pad_e6024
  round 0.8 hole 0.4: 230(0,0)
Pad_e6025
  round 0.8 hole 0.4: 231(0,0)
Pad_e6026
  round 0.8 hole 0.4: 232(0,0)
Pad_e6027
  round 0.8 hole 0.4: 233(0,0)
Pad_e6028
  round 0.8 hole 0.4: 234(0,0)
Pad_e6029
  round 0.8 hole 0.4: 235(0,0)
Pad_e6030
  round 0.8 hole 0.4: 236(0,0)
Pad_e6031
  round 0.8 hole 0.4: 237(0,0)
Pad_e6032
  round 0.8 hole 0.4: 238(0,0)
Pad_e6033
  round 0.8 hole 0.4: 239(0,0)
Pad_e6034
  round 0.8 hole 0.4: 240(0,0)
Pad_e6035
  round 0.8 hole 0.4: 241(0,0)
Pad_e6036
  round 0.8 hole 0.4: 242(0,0)
Pad_e6037
  round 0.8 hole 0.4: 243(0,0)
Pad_e6038
  round 0.8 hole 0.4: 244(0,0)
Pad_e6039
  round 0.8 hole 0.4: 245(0,0)
Pad_e6040
  round 0.8 hole 0.4: 246(0,0)
Pad_e6041
  round 0.8 hole 0.4: 247(0,0)
Pad_e6042
  round 0.8 hole 0.4: 248(0,0)
Pad_e6043
  round 0.8 hole 0.4: 249(0,0)
Pad_e6044
  round 0.8 hole 0.4: 250(0,0)
Pad_e6045
  round 0.8 hole 0.4: 251(0,0)
Pad_e6046
  round 0.8 hole 0.4: 252(0,0)
Pad_e6047
  round 0.8 hole 0.4: 253(0,0)
Pad_e6048
  round 0.8 hole 0.4: 254(0,0)
Pad_e6049
  round 0.8 hole 0.4: 255(0,0)
Pad_e6050
  round 0.8 hole 0.4: 256(0,0)
Pad_e6051
  round 0.8 hole 0.4: 257(0,0)
Pad_e6052
  round 0.8 hole 0.4: 258(0,0)
Pad_e6053
  round 0.8 hole 0.4: 259(0,0)
Pad_e6054
  round 0.8 hole 0.4: 260(0,0)
Pad_e6055
  round 0.8 hole 0.4: 261(0,0)
Pad_e6056
  round 0.8 hole 0.4: 262(0,0)
Pad_e6057
  round 0.8 hole 0.4: 263(0,0)
Pad_e6058
  round 0.8 hole 0.4: 264(0,0)
Pad_e6059
  round 0.8 hole 0.4: 265(0,0)
Pad_e6060
  round 0.8 hole 0.4: 266(0,0)
Pad_e6061
  round 0.8 hole 0.4: 267(0,0)
Pad_e6062
  round 0.8 hole 0.4: 268(0,0)
Pad_e6063
  round 0.8 hole 0.4: 269(0,0)
Pad_e6069
  round 0.8 hole 0.4: 275(0,0)
Pad_e6070
  round 0.8 hole 0.4: 276(0,0)
Pad_e6071
  round 0.8 hole 0.4: 277(0,0)
Pad_e6072
  round 0.8 hole 0.4: 278(0,0)
Pad_e6073
  round 0.8 hole 0.4: 279(0,0)
Pad_e6074
  round 0.8 hole 0.4: 280(0,0)
Pad_e6075
  round 0.8 hole 0.4: 281(0,0)
Pad_e6076
  round 0.8 hole 0.4: 282(0,0)
Pad_e6077
  round 0.8 hole 0.4: 283(0,0)
Pad_e6078
  round 0.8 hole 0.4: 284(0,0)
Pad_e6094
  round 0.8 hole 0.4: 300(0,0)
Pad_e6095
  round 0.8 hole 0.4: 301(0,0)
Pad_e6096
  round 0.8 hole 0.4: 302(0,0)
Pad_e6097
  round 0.8 hole 0.4: 303(0,0)
Pad_e6098
  round 0.8 hole 0.4: 304(0,0)
Pad_e6099
  round 0.8 hole 0.4: 305(0,0)
Pad_e6100
  round 0.8 hole 0.4: 306(0,0)
Pad_e6101
  round 0.8 hole 0.4: 307(0,0)
Pad_e6102
  round 0.8 hole 0.4: 308(0,0)
Pad_e6103
  round 0.8 hole 0.4: 309(0,0)
Pad_e6119
  round 0.8 hole 0.4: 325(0,0)
Pad_e6120
  round 0.8 hole 0.4: 326(0,0)
Pad_e6121
  round 0.8 hole 0.4: 327(0,0)
Pad_e6122
  round 0.8 hole 0.4: 328(0,0)
Pad_e6123
  round 0.8 hole 0.4: 329(0,0)
Pad_e6124
  round 0.8 hole 0.4: 330(0,0)
Pad_e6125
  round 0.8 hole 0.4: 331(0,0)
Pad_e6126
  round 0.8 hole 0.4: 332(0,0)
Pad_e6127
  round 0.8 hole 0.4: 333(0,0)
Pad_e6128
  round 0.8 hole 0.4: 334(0,0)
Pad_e6144
  round 0.8 hole 0.4: 350(0,0)
Pad_e6145
  round 0.8 hole 0.4: 351(0,0)
Pad_e6146
  round 0.8 hole 0.4: 352(0,0)
Pad_e6147
  round 0.8 hole 0.4: 353(0,0)
Pad_e6148
  round 0.8 hole 0.4: 354(0,0)
Pad_e6149
  round 0.8 hole 0.4: 355(0,0)
Pad_e6150
  round 0.8 hole 0.4: 356(0,0)
Pad_e6151
  round 0.8 hole 0.4: 357(0,0)
Pad_e6152
  round 0.8 hole 0.4: 358(0,0)
Pad_e6153
  round 0.8 hole 0.4: 359(0,0)
Pad_e6169
  round 0.8 hole 0.4: 375(0,0)
Pad_e6170
  round 0.8 hole 0.4: 376(0,0)
Pad_e6171
  round 0.8 hole 0.4: 377(0,0)
Pad_e6172
  round 0.8 hole 0.4: 378(0,0)
Pad_e6173
  round 0.8 hole 0.4: 379(0,0)
Pad_e6174
  round 0.8 hole 0.4: 380(0,0)
Pad_e6175
  round 0.8 hole 0.4: 381(0,0)
Pad_e6176
  round 0.8 hole 0.4: 382(0,0)
Pad_e6177
  round 0.8 hole 0.4: 383(0,0)
Pad_e6178
  round 0.8 hole 0.4: 384(0,0)
Pad_e6179
  round 0.8 hole 0.4: 385(0,0)
Pad_e6180
  round 0.8 hole 0.4: 386(0,0)
Pad_e6181
  round 0.8 hole 0.4: 387(0,0)
Pad_e6182
  round 0.8 hole 0.4: 388(0,0)
Pad_e6183
  round 0.8 hole 0.4: 389(0,0)
Pad_e6184
  round 0.8 hole 0.4: 390(0,0)
Pad_e6185
  round 0.8 hole 0.4: 391(0,0)
Pad_e6188
  round 0.8 hole 0.4: 394(0,0)
Pad_e6194
  round 0.8 hole 0.4: 400(0,0)
Pad_e6195
  round 0.8 hole 0.4: 401(0,0)
Pad_e6196
  round 0.8 hole 0.4: 402(0,0)
Pad_e6197
  round 0.8 hole 0.4: 403(0,0)
Pad_e6198
  round 0.8 hole 0.4: 404(0,0)
Pad_e6199
  round 0.8 hole 0.4: 405(0,0)
Pad_e6200
  round 0.8 hole 0.4: 406(0,0)
Pad_e6201
  round 0.8 hole 0.4: 407(0,0)
Pad_e6202
  round 0.8 hole 0.4: 408(0,0)
Pad_e6203
  round 0.8 hole 0.4: 409(0,0)
Pad_e6204
  round 0.8 hole 0.4: 410(0,0)
Pad_e6205
  round 0.8 hole 0.4: 411(0,0)
Pad_e6206
  round 0.8 hole 0.4: 412(0,0)
Pad_e6207
  round 0.8 hole 0.4: 413(0,0)
Pad_e6208
  round 0.8 hole 0.4: 414(0,0)
Pad_e6209
  round 0.8 hole 0.4: 415(0,0)
Pad_e6210
  round 0.8 hole 0.4: 416(0,0)
Pad_e6211
  round 0.8 hole 0.4: 417(0,0)
Pad_e6212
  round 0.8 hole 0.4: 418(0,0)
Pad_e6213
  round 0.8 hole 0.4: 419(0,0)
Pad_e6214
  round 0.8 hole 0.4: 420(0,0)
Pad_e6215
  round 0.8 hole 0.4: 421(0,0)
Pad_e6216
  round 0.8 hole 0.4: 422(0,0)
Pad_e6217
  round 0.8 hole 0.4: 423(0,0)
Pad_e6218
  round 0.8 hole 0.4: 424(0,0)
Pad_e6219
  round 0.8 hole 0.4: 425(0,0)
Pad_e6220
  round 0.8 hole 0.4: 426(0,0)
Pad_e6221
  round 0.8 hole 0.4: 427(0,0)
Pad_e6222
  round 0.8 hole 0.4: 428(0,0)
Pad_e6223
  round 0.8 hole 0.4: 429(0,0)
Pad_e6224
  round 0.8 hole 0.4: 430(0,0)
Pad_e6225
  round 0.8 hole 0.4: 431(0,0)
Pad_e6226
  round 0.8 hole 0.4: 432(0,0)
Pad_e6227
  round 0.8 hole 0.4: 433(0,0)
Pad_e6228
  round 0.8 hole 0.4: 434(0,0)
Pad_e6229
  round 0.8 hole 0.4: 435(0,0)
Pad_e6230
  round 0.8 hole 0.4: 436(0,0)
Pad_e6231
  round 0.8 hole 0.4: 437(0,0)
Pad_e6232
  round 0.8 hole 0.4: 438(0,0)
Pad_e6233
  round 0.8 hole 0.4: 439(0,0)
Pad_e6234
  round 0.8 hole 0.4: 440(0,0)
Pad_e6235
  round 0.8 hole 0.4: 441(0,0)
Pad_e6236
  round 0.8 hole 0.4: 442(0,0)
Pad_e6237
  round 0.8 hole 0.4: 443(0,0)
Pad_e6238
  round 0.8 hole 0.4: 444(0,0)
Pad_e6239
  round 0.8 hole 0.4: 445(0,0)
Pad_e6240
  round 0.8 hole 0.4: 446(0,0)
Pad_e6241
  round 0.8 hole 0.4: 447(0,0)
Pad_e6242
  round 0.8 hole 0.4: 448(0,0)
Pad_e6243
  round 0.8 hole 0.4: 449(0,0)
Pad_e6244
  round 0.8 hole 0.4: 450(0,0)
Pad_e6245
  round 0.8 hole 0.4: 451(0,0)
Pad_e6246
  round 0.8 hole 0.4: 452(0,0)
Pad_e6247
  round 0.8 hole 0.4: 453(0,0)
Pad_e6248
  round 0.8 hole 0.4: 454(0,0)
Pad_e6249
  round 0.8 hole 0.4: 455(0,0)
Pad_e6250
  round 0.8 hole 0.4: 456(0,0)
Pad_e6251
  round 0.8 hole 0.4: 457(0,0)
Pad_e6252
  round 0.8 hole 0.4: 458(0,0)
Pad_e6253
  round 0.8 hole 0.4: 459(0,0)
Pad_e6254
  round 0.8 hole 0.4: 460(0,0)
Pad_e6255
  round 0.8 hole 0.4: 461(0,0)
Pad_e6256
  round 0.8 hole 0.4: 462(0,0)
Pad_e6257
  round 0.8 hole 0.4: 463(0,0)
Pad_e6258
  round 0.8 hole 0.4: 464(0,0)
Pad_e6259
  round 0.8 hole 0.4: 465(0,0)
Pad_e6260
  round 0.8 hole 0.4: 466(0,0)
Pad_e6261
  round 0.8 hole 0.4: 467(0,0)
Pad_e6262
  round 0.8 hole 0.4: 468(0,0)
Pad_e6263
  round 0.8 hole 0.4: 469(0,0)
Pad_e6264
  round 0.8 hole 0.4: 470(0,0)
Pad_e6265
  round 0.8 hole 0.4: 471(0,0)
Pad_e6266
  round 0.8 hole 0.4: 472(0,0)
Pad_e6267
  round 0.8 hole 0.4: 473(0,0)
Pad_e6268
  round 0.8 hole 0.4: 474(0,0)
Pad_e6269
  round 0.8 hole 0.4: 475(0,0)
Pad_e6270
  round 0.8 hole 0.4: 476(0,0)
Pad_e6271
  round 0.8 hole 0.4: 477(0,0)
Pad_e6272
  round 0.8 hole 0.4: 478(0,0)
Pad_e6273
  round 0.8 hole 0.4: 479(0,0)
Pad_e6274
  round 0.8 hole 0.4: 480(0,0)
Pad_e6275
  round 0.8 hole 0.4: 481(0,0)
Pad_e6276
  round 0.8 hole 0.4: 482(0,0)
Pad_e6277
  round 0.8 hole 0.4: 483(0,0)
Pad_e6278
  round 0.8 hole 0.4: 484(0,0)
Pad_e6279
  round 0.8 hole 0.4: 485(0,0)
Pad_e6280
  round 0.8 hole 0.4: 486(0,0)
Pad_e6281
  round 0.8 hole 0.4: 487(0,0)
Pad_e6282
  round 0.8 hole 0.4: 488(0,0)
Pad_e6283
  round 0.8 hole 0.4: 489(0,0)
Pad_e6284
  round 0.8 hole 0.4: 490(0,0)
Pad_e6285
  round 0.8 hole 0.4: 491(0,0)
Pad_e6286
  round 0.8 hole 0.4: 492(0,0)
Pad_e6287
  round 0.8 hole 0.4: 493(0,0)
Pad_e6288
  round 0.8 hole 0.4: 494(0,0)
Pad_e6289
  round 0.8 hole 0.4: 495(0,0)
Pad_e6290
  round 0.8 hole 0.4: 496(0,0)
Pad_e6291
  round 0.8 hole 0.4: 497(0,0)
Pad_e6292
  round 0.8 hole 0.4: 498(0,0)
Pad_e6293
  round 0.8 hole 0.4: 499(0,0)
Pad_e6294
  round 0.8 hole 0.4: 500(0,0)
Pad_e6295
  round 0.8 hole 0.4: 501(0,0)
Pad_e6296
  round 0.8 hole 0.4: 502(0,0)
Pad_e6297
  round 0.8 hole 0.4: 503(0,0)
Pad_e6298
  round 0.8 hole 0.4: 504(0,0)
Pad_e6299
  round 0.8 hole 0.4: 505(0,0)
Pad_e6300
  round 0.8 hole 0.4: 506(0,0)
Pad_e6301
  round 0.8 hole 0.4: 507(0,0)
Pad_e6302
  round 0.8 hole 0.4: 508(0,0)
Pad_e6303
  round 0.8 hole 0.4: 509(0,0)
Pad_e6304
  round 0.8 hole 0.4: 510(0,0)
Pad_e6305
  round 0.8 hole 0.4: 511(0,0)
Pad_e6306
  round 0.8 hole 0.4: 512(0,0)
Pad_e6307
  round 0.8 hole 0.4: 513(0,0)
Pad_e6308
  round 0.8 hole 0.4: 514(0,0)
Pad_e6309
  round 0.8 hole 0.4: 515(0,0)
Pad_e6310
  round 0.8 hole 0.4: 516(0,0)
Pad_e6311
  round 0.8 hole 0.4: 517(0,0)
Pad_e6312
  round 0.8 hole 0.4: 518(0,0)
Pad_e6313
  round 0.8 hole 0.4: 519(0,0)
Pad_e6314
  round 0.8 hole 0.4: 520(0,0)
Pad_e6315
  round 0.8 hole 0.4: 521(0,0)
Pad_e6316
  round 0.8 hole 0.4: 522(0,0)
Pad_e6317
  round 0.8 hole 0.4: 523(0,0)
Pad_e6318
  round 0.8 hole 0.4: 524(0,0)
Pad_e6319
  round 0.8 hole 0.4: 525(0,0)
Pad_e6320
  round 0.8 hole 0.4: 526(0,0)
Pad_e6321
  round 0.8 hole 0.4: 527(0,0)
Pad_e6322
  round 0.8 hole 0.4: 528(0,0)
Pad_e6323
  round 0.8 hole 0.4: 529(0,0)
Pad_e6324
  round 0.8 hole 0.4: 530(0,0)
Pad_e6325
  round 0.8 hole 0.4: 531(0,0)
Pad_e6326
  round 0.8 hole 0.4: 532(0,0)
Pad_e6327
  round 0.8 hole 0.4: 533(0,0)
Pad_e6328
  round 0.8 hole 0.4: 534(0,0)
Pad_e6331
  round 0.8 hole 0.4: 537(0,0)
Pad_e6332
  round 0.8 hole 0.4: 538(0,0)
Pad_e6333
  round 0.8 hole 0.4: 539(0,0)
Pad_e6334
  round 0.8 hole 0.4: 540(0,0)
Pad_e6335
  round 0.8 hole 0.4: 541(0,0)
Pad_e6336
  round 0.8 hole 0.4: 542(0,0)
Pad_e6337
  round 0.8 hole 0.4: 543(0,0)
Pad_e6338
  round 0.8 hole 0.4: 544(0,0)
Pad_e6339
  round 0.8 hole 0.4: 545(0,0)
Pad_e6340
  round 0.8 hole 0.4: 546(0,0)
Pad_e6341
  round 0.8 hole 0.4: 547(0,0)
Pad_e6342
  round 0.8 hole 0.4: 548(0,0)
Pad_e6343
  round 0.8 hole 0.4: 549(0,0)
Pad_e6344
  round 0.8 hole 0.4: 550(0,0)
Pad_e6345
  round 0.8 hole 0.4: 551(0,0)
Pad_e6346
  round 0.8 hole 0.4: 552(0,0)
Pad_e6347
  round 0.8 hole 0.4: 553(0,0)
Pad_e6348
  round 0.8 hole 0.4: 554(0,0)
Pad_e6349
  round 0.8 hole 0.4: 555(0,0)
Pad_e6350
  round 0.8 hole 0.4: 556(0,0)
Pad_e6356
  round 0.8 hole 0.4: 562(0,0)
Pad_e6357
  round 0.8 hole 0.4: 563(0,0)
Pad_e6358
  round 0.8 hole 0.4: 564(0,0)
Pad_e6359
  round 0.8 hole 0.4: 565(0,0)
Pad_e6360
  round 0.8 hole 0.4: 566(0,0)
Pad_e6361
  round 0.8 hole 0.4: 567(0,0)
Pad_e6362
  round 0.8 hole 0.4: 568(0,0)
Pad_e6363
  round 0.8 hole 0.4: 569(0,0)
Pad_e6364
  round 0.8 hole 0.4: 570(0,0)
Pad_e6365
  round 0.8 hole 0.4: 571(0,0)
Pad_e6366
  round 0.8 hole 0.4: 572(0,0)
Pad_e6367
  round 0.8 hole 0.4: 573(0,0)
Pad_e6368
  round 0.8 hole 0.4: 574(0,0)
Pad_e6369
  round 0.8 hole 0.4: 575(0,0)
Pad_e6370
  round 0.8 hole 0.4: 576(0,0)
Pad_e6371
  round 0.8 hole 0.4: 577(0,0)
Pad_e6372
  round 0.8 hole 0.4: 578(0,0)
Pad_e6373
  round 0.8 hole 0.4: 579(0,0)
Pad_e6374
  round 0.8 hole 0.4: 580(0,0)
Pad_e6375
  round 0.8 hole 0.4: 581(0,0)
Pad_e6381
  round 0.8 hole 0.4: 587(0,0)
Pad_e6382
  round 0.8 hole 0.4: 588(0,0)
Pad_e6383
  round 0.8 hole 0.4: 589(0,0)
Pad_e6384
  round 0.8 hole 0.4: 590(0,0)
Pad_e6385
  round 0.8 hole 0.4: 591(0,0)
Pad_e6386
  round 0.8 hole 0.4: 592(0,0)
Pad_e6387
  round 0.8 hole 0.4: 593(0,0)
Pad_e6388
  round 0.8 hole 0.4: 594(0,0)
Pad_e6389
  round 0.8 hole 0.4: 595(0,0)
Pad_e6390
  round 0.8 hole 0.4: 596(0,0)
Pad_e6391
  round 0.8 hole 0.4: 597(0,0)
Pad_e6392
  round 0.8 hole 0.4: 598(0,0)
Pad_e6393
  round 0.8 hole 0.4: 599(0,0)
Pad_e6394
  round 0.8 hole 0.4: 600(0,0)
Pad_e6395
  round 0.8 hole 0.4: 601(0,0)
Pad_e6396
  round 0.8 hole 0.4: 602(0,0)
Pad_e6397
  round 0.8 hole 0.4: 603(0,0)
Pad_e6398
  round 0.8 hole 0.4: 604(0,0)
Pad_e6399
  round 0.8 hole 0.4: 605(0,0)
Pad_e6400
  round 0.8 hole 0.4: 606(0,0)
Pad_e6406
  round 0.8 hole 0.4: 612(0,0)
Pad_e6407
  round 0.8 hole 0.4: 613(0,0)
Pad_e6408
  round 0.8 hole 0.4: 614(0,0)
Pad_e6409
  round 0.8 hole 0.4: 615(0,0)
Pad_e6410
  round 0.8 hole 0.4: 616(0,0)
Pad_e6411
  round 0.8 hole 0.4: 617(0,0)
Pad_e6412
  round 0.8 hole 0.4: 618(0,0)
Pad_e6413
  round 0.8 hole 0.4: 619(0,0)
Pad_e6414
  round 0.8 hole 0.4: 620(0,0)
Pad_e6415
  round 0.8 hole 0.4: 621(0,0)
Pad_e6416
  round 0.8 hole 0.4: 622(0,0)
Pad_e6417
  round 0.8 hole 0.4: 623(0,0)
Pad_e6418
  round 0.8 hole 0.4: 624(0,0)
Pad_e6419
  round 0.8 hole 0.4: 625(0,0)
Pad_e6420
  round 0.8 hole 0.4: 626(0,0)
Pad_e6421
  round 0.8 hole 0.4: 627(0,0)
Pad_e6422
  round 0.8 hole 0.4: 628(0,0)
Pad_e6423
  round 0.8 hole 0.4: 629(0,0)
Pad_e6424
  round 0.8 hole 0.4: 630(0,0)
Pad_e6425
  round 0.8 hole 0.4: 631(0,0)
R0402
  rect 0.566x0.54 smd: 1(-0.433,0) 2(0.433,0)
RES-SMD_L6.4-W3.2-1
  rect 2.5x3.4 smd: 1(-3.1,0) 2(3.1,0)
SMB_L4.3-W3.6-LS5.4-R-RD
  rect 1.96x2.94 smd: 1(2.38,0) 2(-2.38,0)
SOT-23-3_L2.9-W1.3-P1.90-LS2.4-BR
  rect 1.25x0.7 smd: 1(1,-0.95) 2(1,0.95) 3(-1,0)
SW-TH_SK12D07VG4
  round 1.524 hole 0.914: 1(-2,0) 2(0,0) 3(2,0)
  oval 1.4x2.2 hole 0.8x1.6: 4(4.15,0) 5(-4.15,0)

## Nets
